# EasyEDA schematic Dazzler-noaudio.json

## Sheets
1 MCU
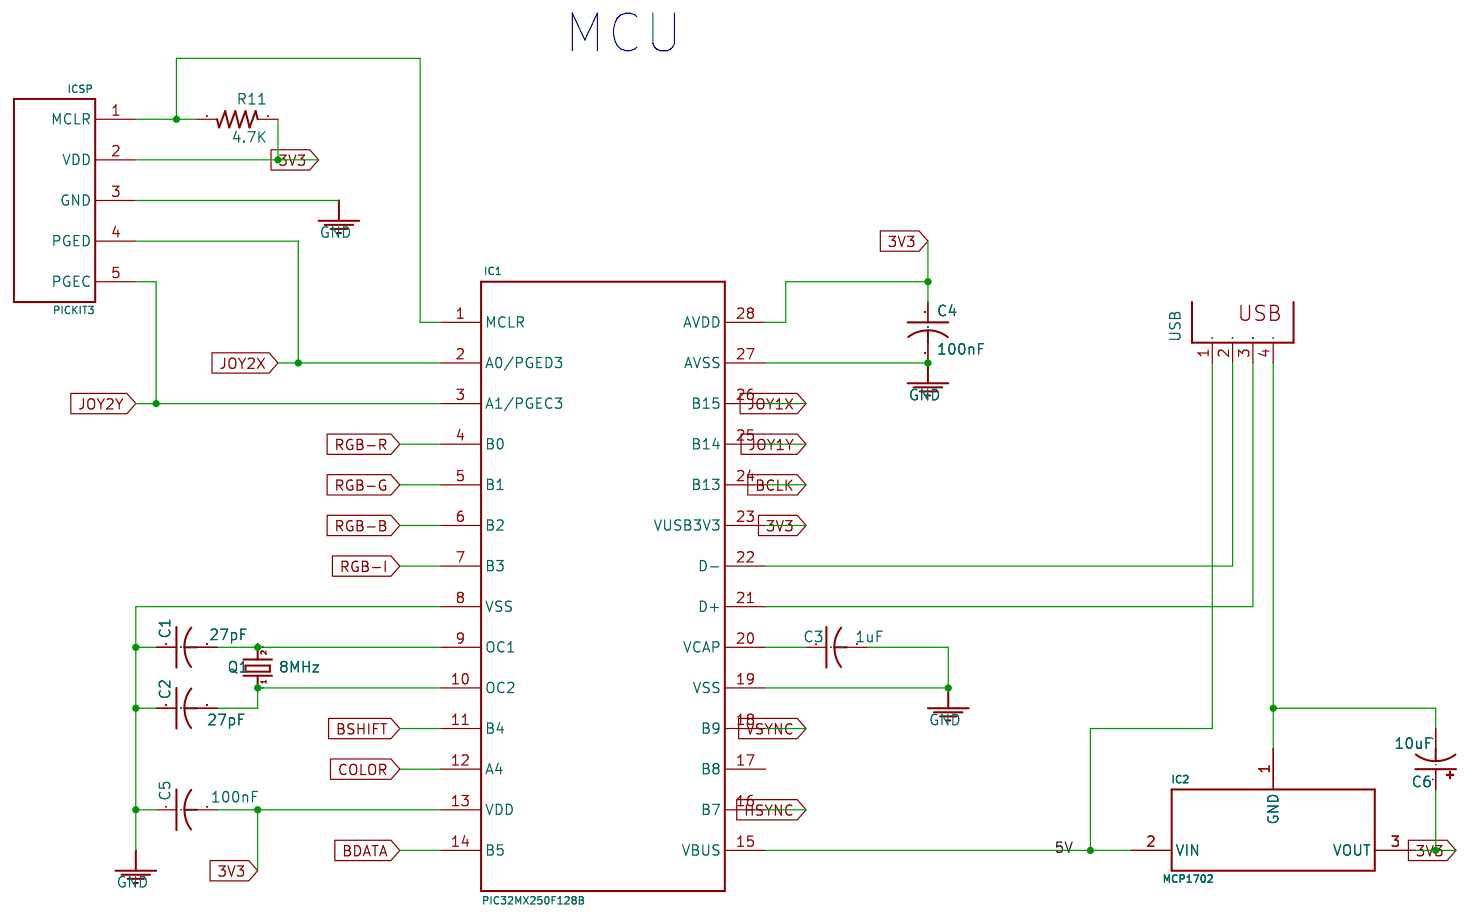
[diagram p0: MCU]
2 Video
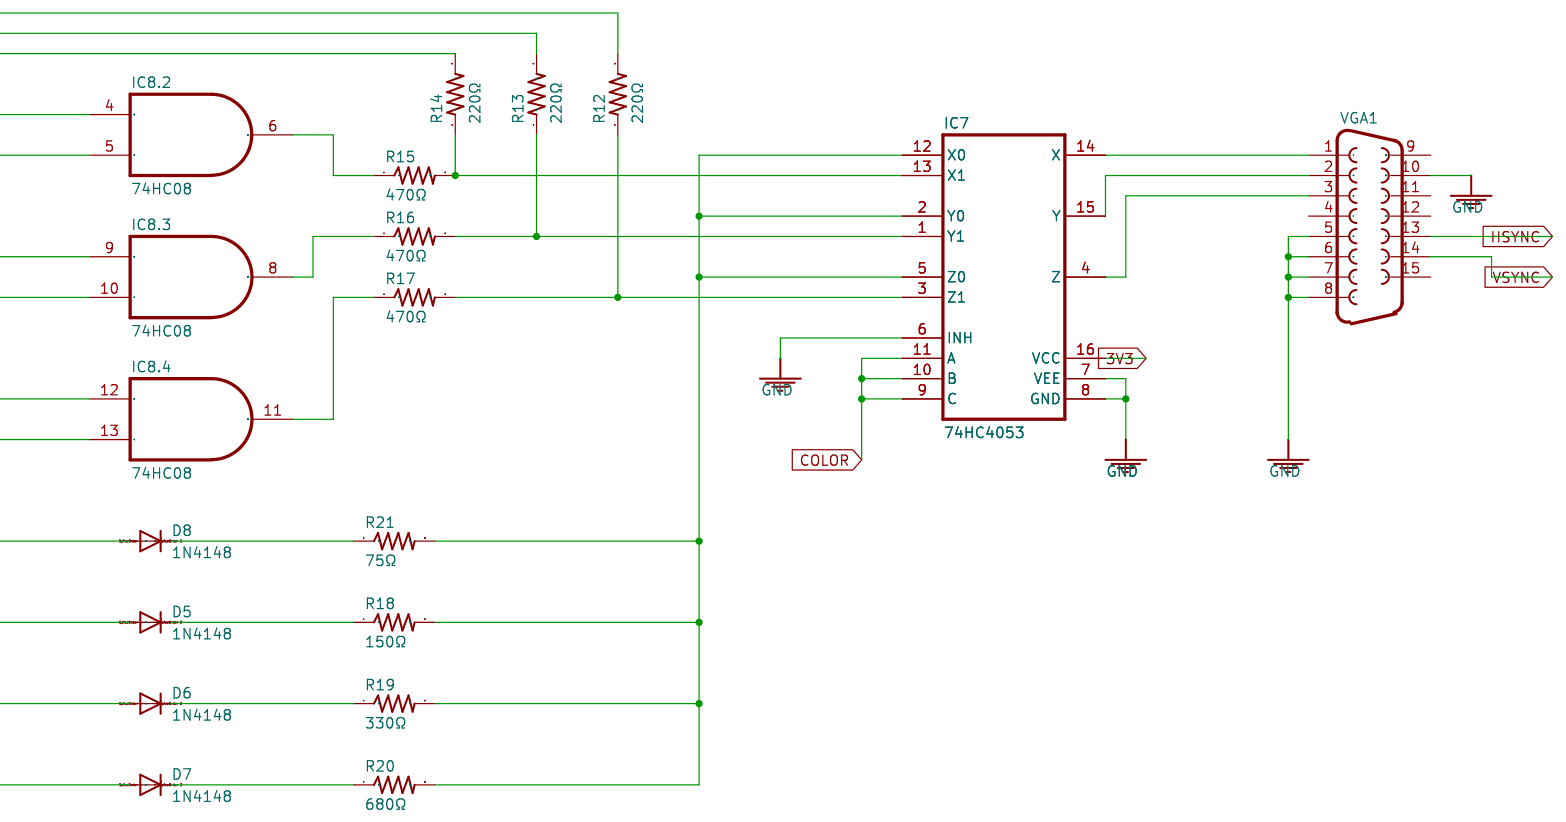
[diagram p1: Video]
3 Joystick
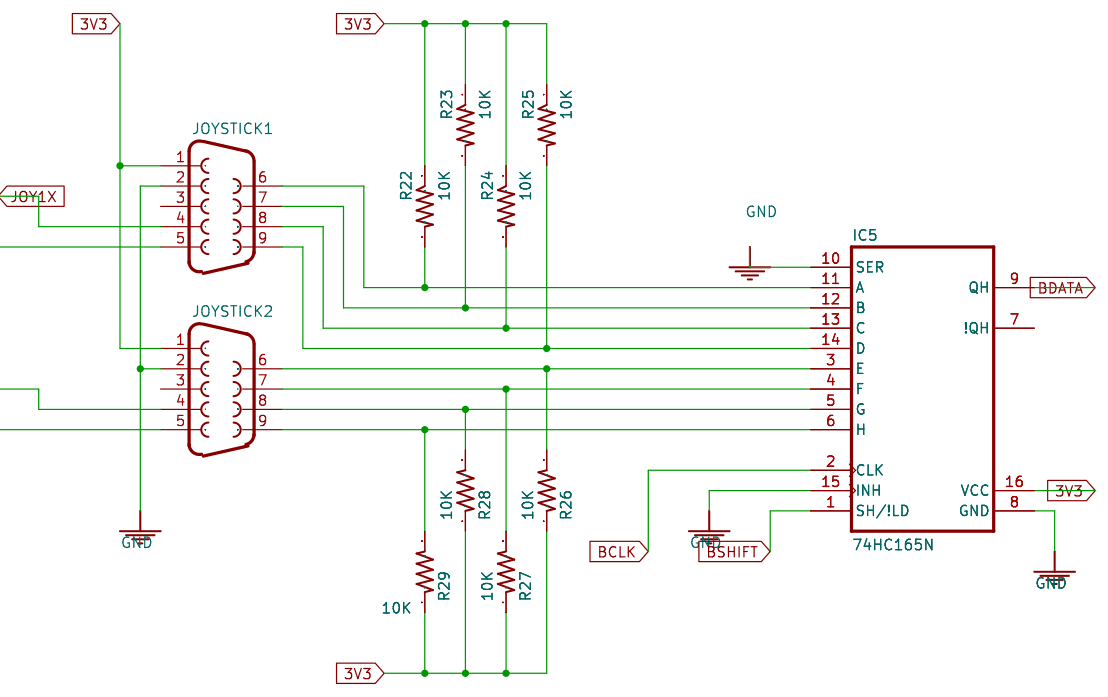
[diagram p2: Joystick]

## Parts
sheet Joystick
IC5  74HC165N  [DIL16]
JOYSTICK1  F09V  [F09V]
JOYSTICK2  F09V  [F09V]
R22  10K  [P0613/15]
R23  10K  [P0613/15]
R24  10K  [P0613/15]
R25  10K  [P0613/15]
R26  10K  [P0613/15]
R27  10K  [P0613/15]
R28  10K  [P0613/15]
R29  10K  [P0613/15]
sheet MCU
C1  27pF  [C025-024X044]
C2  27pF  [C025-024X044]
C3  1uF  [C025-024X044]
C4  100nF  [C025-024X044]
C5  100nF  [C025-024X044]
C6  10uF  [E15-6]
IC1  PIC32MX250F128B  [DIL28-3]
IC2  MCP1702  [TO92]
ICSP  PICKIT3  [1X05]
Q1  8MHz  [HC33U-V]
R11  4.7K  [P0613/15]
USB  PN61729  [PN61729]
sheet Video
D5  1N4148  [DO35-7]
D6  1N4148  [DO35-7]
D7  1N4148  [DO35-7]
D8  1N4148  [DO35-7]
IC7  74HC4053  [DIL16]
IC8  74HC08  [DIL14]  (sections 2,3,4)
R12  220Ω  [P0613/15]
R13  220Ω  [P0613/15]
R14  220Ω  [P0613/15]
R15  470Ω  [P0613/15]
R16  470Ω  [P0613/15]
R17  470Ω  [P0613/15]
R18  150Ω  [P0613/15]
R19  330Ω  [P0613/15]
R20  680Ω  [P0613/15]
R21  75Ω  [P0613/15]
VGA1  F15HDV  [HDF15V]

## Nets
3V3: C4.1 C5.2 C6.+ IC1.13(VDD) IC1.23(VUSB3V3) IC1.28(AVDD) IC2.3(VOUT) IC5.16(VCC) IC7.16(VCC) ICSP.2(VDD) JOYSTICK1.1 JOYSTICK2.1 R11.1 R22.1 R23.1 R24.1 R25.1 R26.1 R27.1 R28.1 R29.1
5V: IC1.15(VBUS) IC2.2(VIN) USB.1
GND: C1.1 C2.1 C3.2 C4.2 C5.1 IC1.8(VSS) IC1.19(VSS) IC1.27(AVSS) IC5.8(GND) IC5.10(SER) IC5.15(INH) IC7.6(INH) IC7.7(VEE) IC7.8(GND) ICSP.3(GND) JOYSTICK1.2 JOYSTICK2.2 VGA1.5 VGA1.6 VGA1.7 VGA1.8 VGA1.10
BCLK: IC1.24(B13) IC5.2(CLK)
BDATA: IC1.14(B5) IC5.9(QH)
BSHIFT: IC1.11(B4) IC5.1(SH/!LD)
COLOR: IC1.12(A4) IC7.9(C) IC7.10(B) IC7.11(A)
HSYNC: IC1.16(B7) VGA1.13
JOY1X: IC1.26(B15) JOYSTICK1.4
JOY1Y: IC1.25(B14) JOYSTICK1.5
JOY2X: IC1.2(A0/PGED3) ICSP.4(PGED) JOYSTICK2.4
JOY2Y: IC1.3(A1/PGEC3) ICSP.5(PGEC) JOYSTICK2.5
RGB-B: D5.A IC1.6(B2) IC8.12(I0) R12.2
RGB-G: D6.A IC1.5(B1) IC8.9(I0) R13.2
RGB-I: D8.A IC1.7(B3) IC8.5(I1) IC8.10(I1) IC8.13(I1)
RGB-R: D7.A IC1.4(B0) IC8.4(I0) R14.2
VSYNC: IC1.18(B9) VGA1.14
Net-(C1-2): C1.2 IC1.9(OC1) Q1.2
Net-(C2-2): C2.2 IC1.10(OC2) Q1.1
Net-(C3-1): C3.1 IC1.20(VCAP)
Net-(C6--): C6.- IC2.1(GND) USB.4
Net-(D5-C): D5.C R18.1
Net-(D6-C): D6.C R19.1
Net-(D7-C): D7.C R20.1
Net-(D8-C): D8.C R21.1
Net-(IC1-1): IC1.1(MCLR) ICSP.1(MCLR) R11.2
Net-(IC1-21): IC1.21(D+) USB.3
Net-(IC1-22): IC1.22(D-) USB.2
Net-(IC5-3): IC5.3(E) JOYSTICK2.6 R26.2
Net-(IC5-4): IC5.4(F) JOYSTICK2.7 R27.2
Net-(IC5-5): IC5.5(G) JOYSTICK2.8 R28.2
Net-(IC5-6): IC5.6(H) JOYSTICK2.9 R29.2
Net-(IC5-11): IC5.11(A) JOYSTICK1.6 R22.2
Net-(IC5-12): IC5.12(B) JOYSTICK1.7 R23.2
Net-(IC5-13): IC5.13(C) JOYSTICK1.8 R24.2
Net-(IC5-14): IC5.14(D) JOYSTICK1.9 R25.2
Net-(IC7-1): IC7.1(Y1) R13.1 R16.2
Net-(IC7-2): IC7.2(Y0) IC7.5(Z0) IC7.12(X0) R18.2 R19.2 R20.2 R21.2
Net-(IC7-3): IC7.3(Z1) R12.1 R17.2
Net-(IC7-4): IC7.4(Z) VGA1.3
Net-(IC7-13): IC7.13(X1) R14.1 R15.2
Net-(IC7-14): IC7.14(X) VGA1.1
Net-(IC7-15): IC7.15(Y) VGA1.2
Net-(IC8.2-6): IC8.6(O) R15.1
Net-(IC8.3-8): IC8.8(O) R16.1
Net-(IC8.4-11): IC8.11(O) R17.1

Not connected (* = marked no-connect by the designer): IC1 17(B8); IC5 7(!QH); JOYSTICK1 3; JOYSTICK2 3; VGA1 4 9 11 12 15

## Notes on the sheets
sheet 1
- MCU
sheet 2
- Video Signal Generator
sheet 3
- Joysticks
